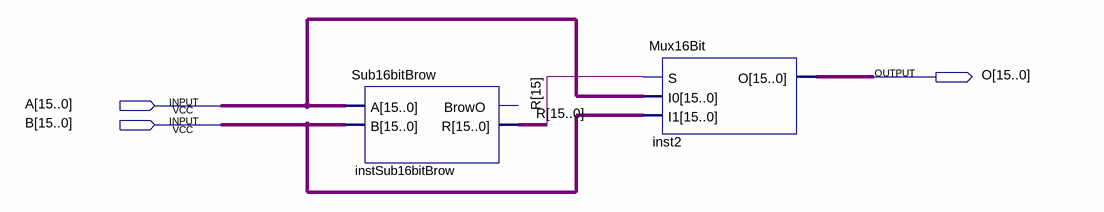
[diagram p0: schematic sheet]
// Quartus schematic Max.bdf as structural Verilog: 2 symbols, 3 pins
module Max (
  input  [15:0] A,
  input  [15:0] B,
  output [15:0] O
);

  wire [15:0] R;

  Sub16bitBrow instSub16bitBrow (.A(A), .B(B), .R(R));  // open: BrowO
  Mux16Bit inst2 (.S(R[15]), .I0(A), .I1(B), .O(O));
endmodule
